# EAGLE design LTF1 (EAGLE 9.6.2)
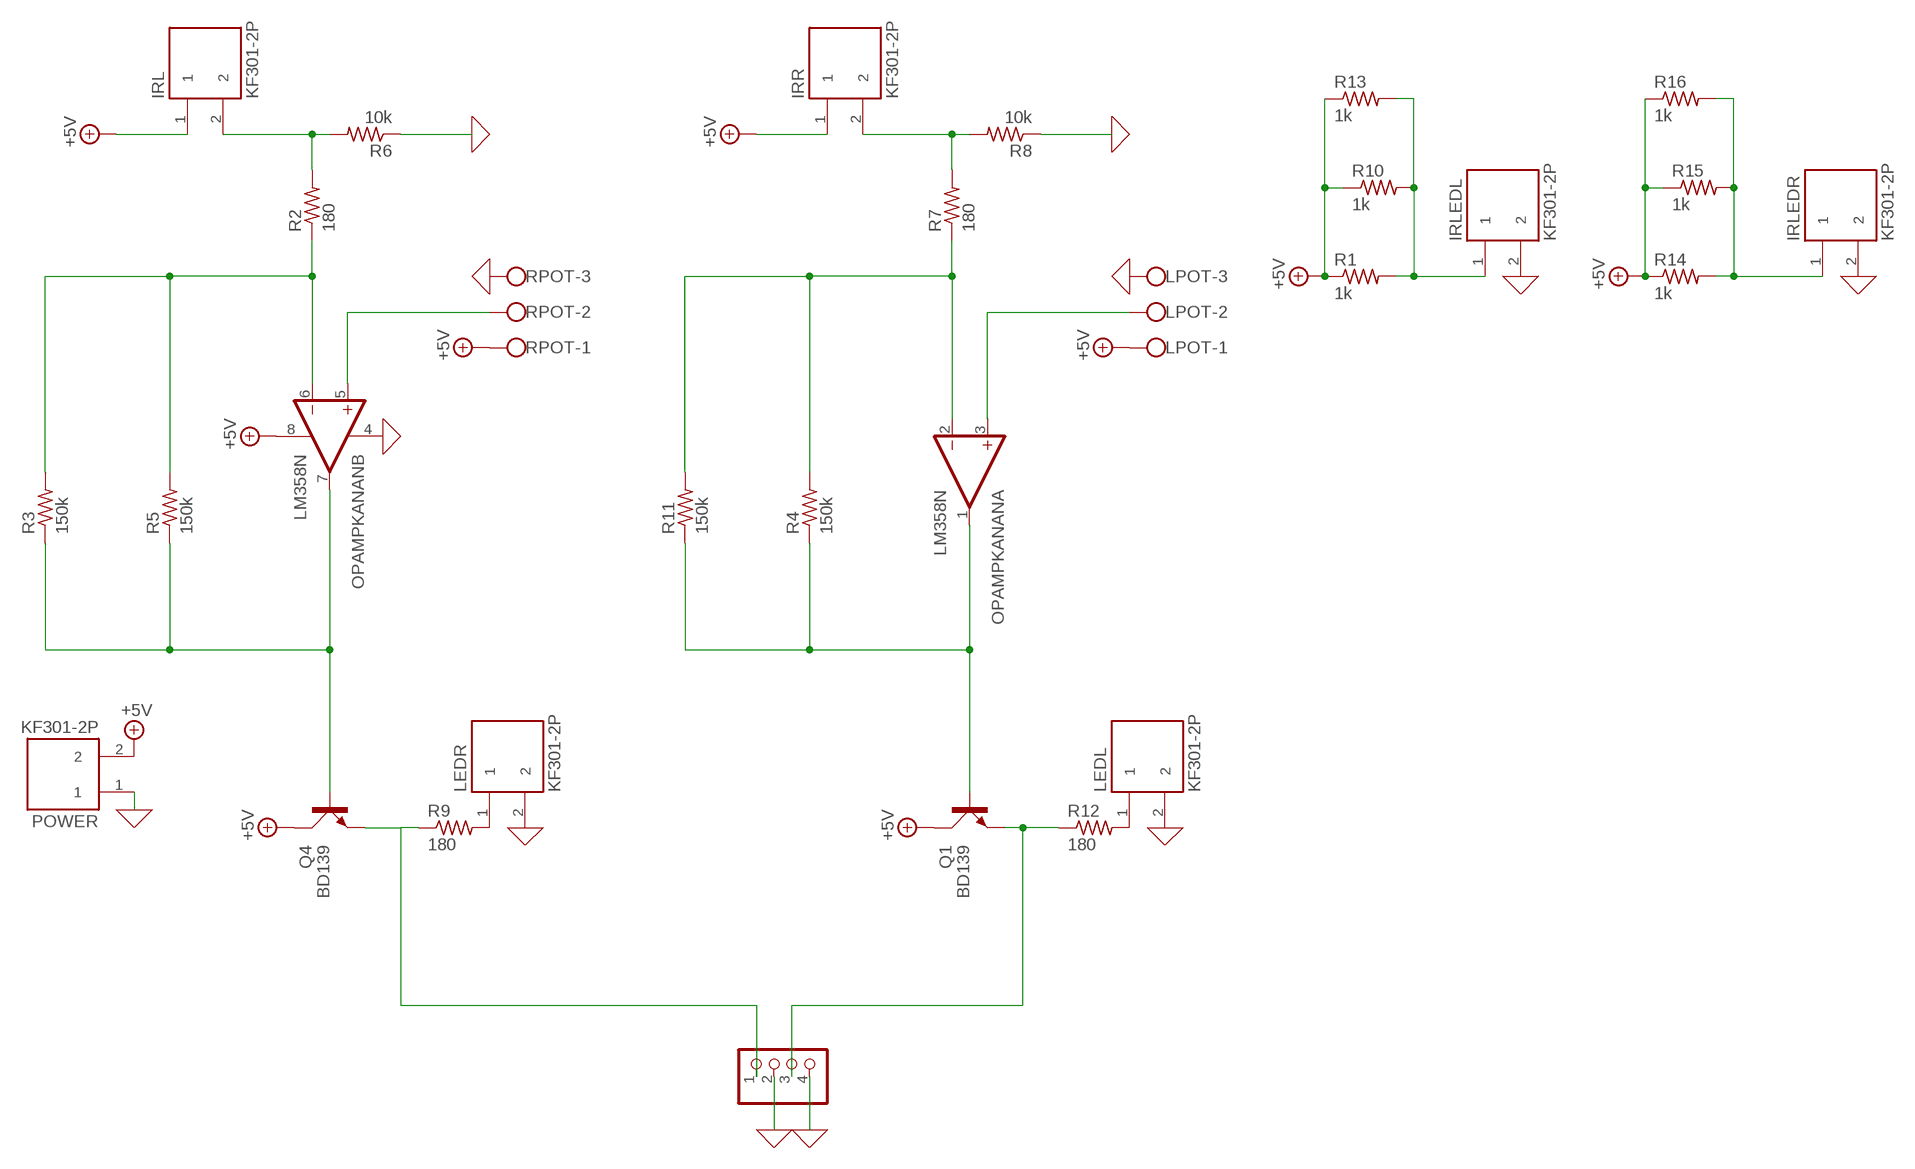
[diagram p0: schematic, sheet 1]

## Parts
IRL  KF301-2P  [HANDSON_KF301-2P]
IRLEDL  KF301-2P  [HANDSON_KF301-2P]
IRLEDR  KF301-2P  [HANDSON_KF301-2P]
IRR  KF301-2P  [HANDSON_KF301-2P]
LEDL  KF301-2P  [HANDSON_KF301-2P]
LEDR  KF301-2P  [HANDSON_KF301-2P]
LPOT  W237-103  [W237-103]
MOTORDRIVER  PINHD-1X4  [1X04]
OPAMPKANAN  LM358N  [DIL08]
POWER  KF301-2P  [HANDSON_KF301-2P]
Q1  BD139  [TO126AV]
Q4  BD139  [TO126AV]
R1  1k  R-US_0204/7  [0204/7]
R2  180  R-US_0204/7  [0204/7]
R3  150k  R-US_0204/7  [0204/7]
R4  150k  R-US_0204/7  [0204/7]
R5  150k  R-US_0204/7  [0204/7]
R6  10k  R-US_0204/7  [0204/7]
R7  180  R-US_0204/7  [0204/7]
R8  10k  R-US_0204/7  [0204/7]
R9  180  R-US_0204/7  [0204/7]
R10  1k  R-US_0204/7  [0204/7]
R11  150k  R-US_0204/7  [0204/7]
R12  180  R-US_0204/7  [0204/7]
R13  1k  R-US_0204/7  [0204/7]
R14  1k  R-US_0204/7  [0204/7]
R15  1k  R-US_0204/7  [0204/7]
R16  1k  R-US_0204/7  [0204/7]
RPOT  W237-103  [W237-103]

## Nets
0: IRLEDL.2 IRLEDR.2 LEDL.2 LEDR.2 LPOT.3 MOTORDRIVER.2 MOTORDRIVER.4 OPAMPKANAN.4(P:V-) POWER.1 R6.1 R8.1 RPOT.3 ; supply symbol labelled GND
+5V: IRL.1 IRR.1 LPOT.1 OPAMPKANAN.8(P:V+) POWER.2 Q1.C Q4.C R1.1 R10.1 R13.1 R14.1 R15.1 R16.1 RPOT.1
IRKIRI: IRL.2 R2.2 R6.2
LEDIRKANAN: IRLEDL.1 R1.2 R10.2 R13.2
LEDIRKANAN1: IRLEDR.1 R14.2 R15.2 R16.2
MOTORKANAN: OPAMPKANAN.7(B:OUT) Q4.B R3.1 R5.1
MOTORKANAN1: OPAMPKANAN.1(A:OUT) Q1.B R4.1 R11.1
N$1: LEDR.1 R9.2
N$2: LEDL.1 R12.2
N$3: OPAMPKANAN.2(A:-IN) R4.2 R7.1 R11.2
N$4: LPOT.2 OPAMPKANAN.3(A:+IN)
N$5: IRR.2 R7.2 R8.2
N$6: MOTORDRIVER.3 Q1.E R12.1
N$7: OPAMPKANAN.6(B:-IN) R2.1 R3.2 R5.2
N$8: MOTORDRIVER.1 Q4.E R9.1
N$10: OPAMPKANAN.5(B:+IN) RPOT.2

## Library data of the parts
IRL IRLEDL IRLEDR IRR LEDL LEDR POWER = KF301-2P:KF301-2P: 2 Pin Terminal Block 5mm Pitch Check availability <https://pricing.snapeda.com/parts/KF301-2P/Handson%20Technology/view-part?ref=eda>; AVAILABILITY: Not in stock; DESCRIPTION: 2 Pin Terminal Block 5mm Pitch; MF: Handson Technology; MP: KF301-2P; PACKAGE: None; PRICE: None
LPOT RPOT = con-wago-500:W237-103: WAGO SCREW CLAMP; MPN: 237-103; OC_FARNELL: unknown; OC_NEWARK: 18M7116
MOTORDRIVER = pinhead:PINHD-1X4: PIN HEADER
OPAMPKANAN = op-amp-long:LM358: OP AMP also LM158; LM258; LM2904 Source: http://cache.national.com/ds/LM/LM158.pdf
Q1 Q4 = transistor-power-small-pad:BD139: NPN TRANSISTOR
R1-R16 = rcl:R-US_: RESISTOR, American symbol; SPICEPREFIX: R

## Board
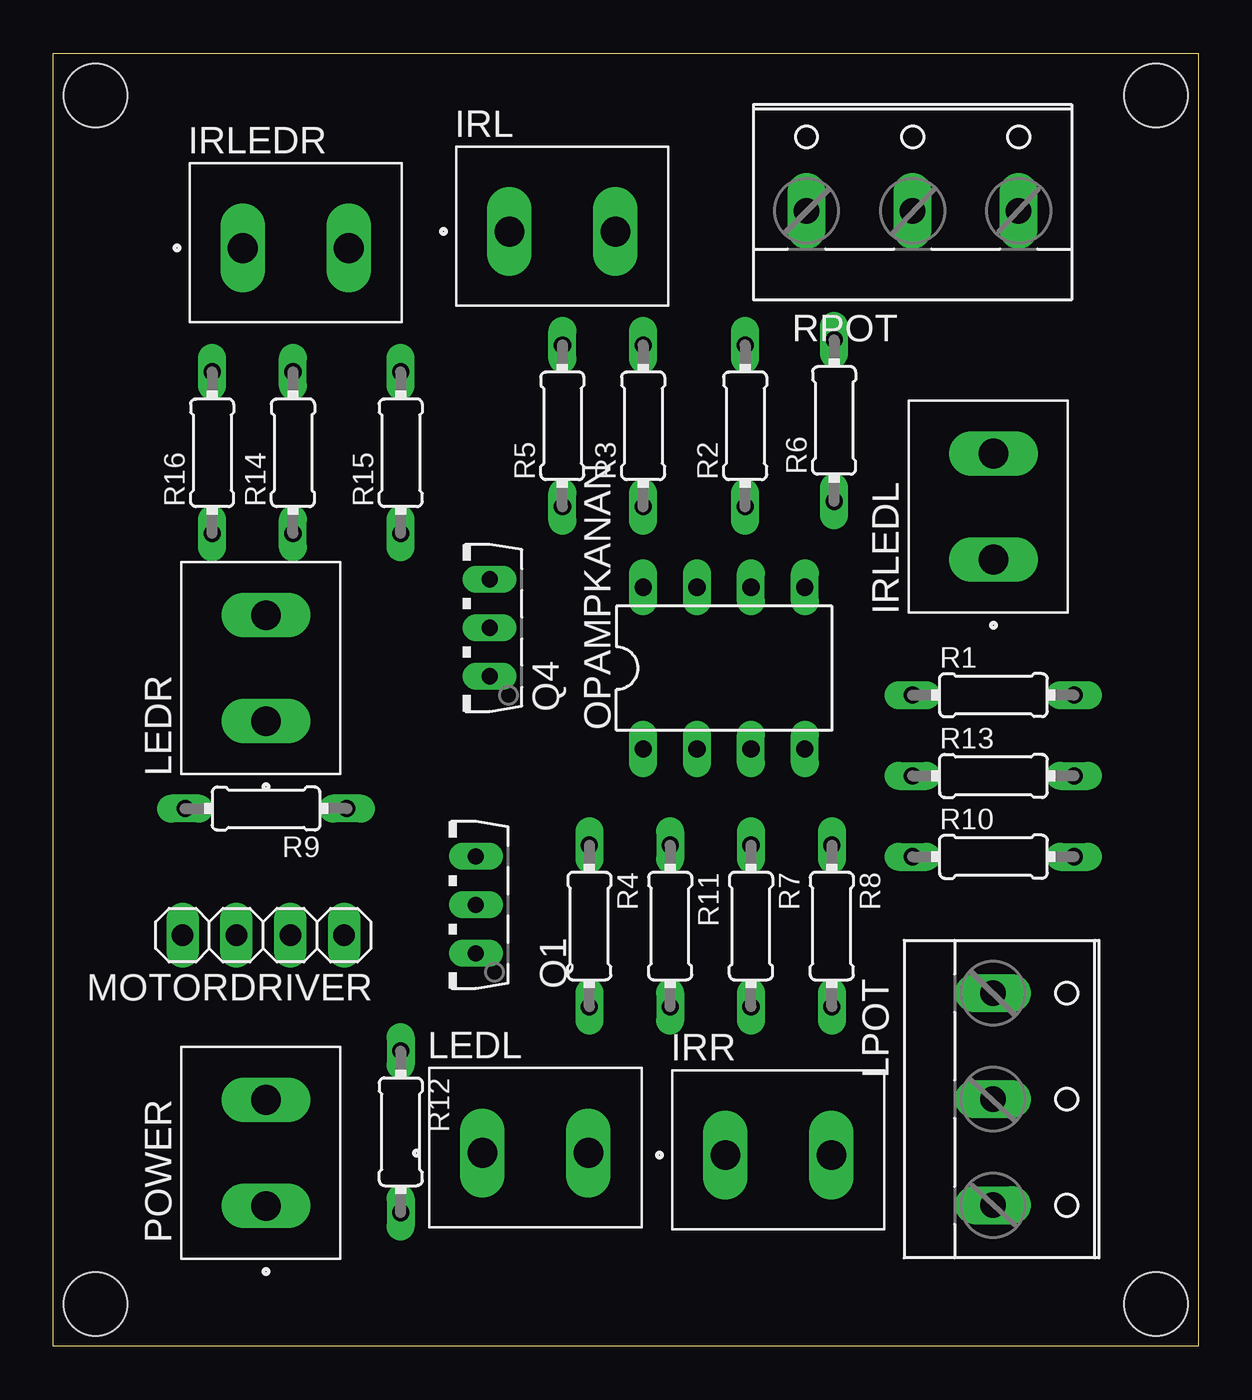
[diagram p1: board, top side]
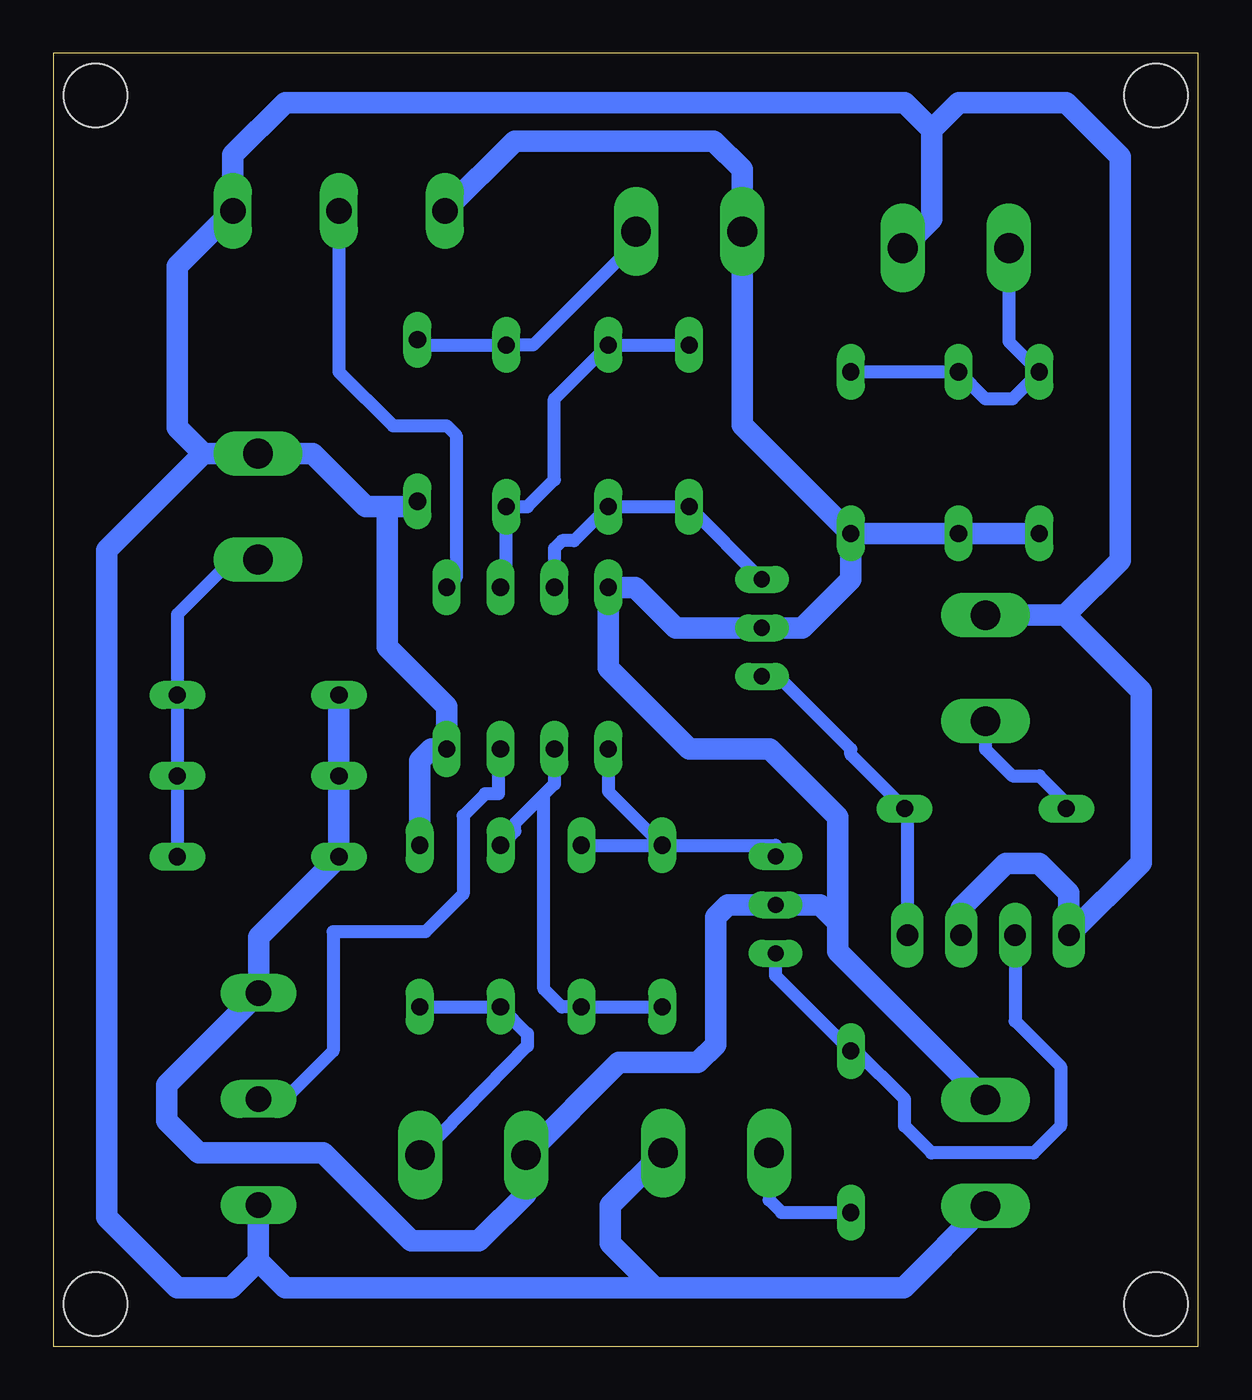
[diagram p2: board, bottom side, seen from below]

Size 54 x 61 mm. Coordinates in mm from the lower left corner, seen from the top.
Outline: 0,0 0,61 54,61 54,0 0,0
Copper layers (1*16): Top 0.035mm / dielectric 1.5mm / Bottom 0.035mm
Design rules "default *": minimum track width 6mil, minimum drill 0.35mm, track to track 0.8mm, track to pad 0.8mm, pad to pad 0.8mm, via to via 0.8mm, smd to smd 0.8mm, copper to edge 40mil, drill to drill 6mil, minimum pad ring 10mil, minimum via ring 8mil, stop-mask expansion 4mil, vias tented up to drill 0mil, thermal gap 10mil
Holes 3 mm at 2,2 52,2 52,59 2,59

### Footprints (pad centres in the part's own frame; a part is rotated, then mirrored left to right if it is on the bottom)
HANDSON_KF301-2P = drill 1.4 long: 1 -2.5,0; 2 2.5,0
W237-103 = drill 1.194 long: 1 -5,-1.29; 2 0,-1.29; 3 5,-1.29
1X04 = drill 1.016 long: 1 -3.81,0; 2 -1.27,0; 3 1.27,0; 4 3.81,0
DIL08 = drill 0.813 pad 1.27 long: 1 -3.81,-3.81; 2 -1.27,-3.81; 3 1.27,-3.81; 4 3.81,-3.81; 5 3.81,3.81; 6 1.27,3.81; 7 -1.27,3.81; 8 -3.81,3.81
TO126AV = drill 0.762 long: B 2.286,-1.27; C 0,-1.27; E -2.286,-1.27
0204/7 = drill 0.813 long: 1 -3.81,0; 2 3.81,0

### Placement (x,y rotation side)
IRL  24.01,52.58 0 top
IRLEDL  44.33,39.61 90 top
IRLEDR  11.44,51.8 0 top
IRR  34.2,9.03 0 top
LEDL  22.74,9.13 0 top
LEDR  10.04,31.99 90 top
LPOT  45.6,11.67 270 top
MOTORDRIVER  9.92,19.4 180 top
OPAMPKANAN  31.63,31.99 0 top
POWER  10.04,9.13 90 top
Q1  18.66,20.83 90 top
Q4  19.31,33.89 90 top
R1  44.33,30.72 0 top
R2  32.63,43.42 90 top
R3  27.82,43.42 90 top
R4  25.28,19.83 270 top
R5  24.01,43.42 90 top
R6  36.82,43.67 90 top
R7  32.9,19.83 270 top
R8  36.71,19.83 270 top
R9  10.04,25.37 180 top
R10  44.33,23.1 0 top
R11  29.09,19.83 270 top
R12  16.39,10.13 270 top
R13  44.33,26.91 0 top
R14  11.31,42.15 90 top
R15  16.39,42.15 90 top
R16  7.5,42.15 90 top
RPOT  40.52,54.85 0 top

### Tracks (layer width: path | path; a pad name or v marks a point on that pad's centre or on a via)
0
  Bottom 1.016: POWER.1 13.89,2.78 25.64,2.78 | 44.33,4.05 43.06,2.78 25.64,2.78 | 44.33,4.05 44.33,6.65 LPOT.3 | 44.33,4.05 45.6,2.78 48.14,2.78 51.46,6.1 51.46,37.56 46.91,42.11 | 46.91,42.11 IRLEDL.2 41.75,42.11 39.25,39.61 38.25,39.61 | 38.25,39.61 37.08,39.61 R6.1 | 38.25,39.61 38.25,32.99 35.44,30.18 OPAMPKANAN.4 36.17,28.18 36.71,27.64 R8.1 | 46.91,42.11 48.14,43.34 48.14,50.94 RPOT.3 45.52,56.2 43.06,58.66 13.85,58.66 12.58,57.39 | 12.58,57.39 12.58,53.16 IRLEDR.2 | 12.58,57.39 11.31,58.66 6.23,58.66 3.69,56.12 3.69,37.07 6.27,34.49 | LEDR.2 6.27,34.49 | 6.27,34.49 2.69,30.91 2.69,22.81 MOTORDRIVER.4 6.11,21.38 7.5,22.78 9.09,22.78 11.19,20.68 MOTORDRIVER.2 | LEDL.2 27.72,6.65 27.72,4.86 25.64,2.78
+5V
  Bottom 1.016: POWER.2 10.04,11.67 17,18.63 17,20 | R15.1 R14.1 R16.1 | R1.1 R13.1 R10.1 44.31,19.31 LPOT.1 48.65,12.33 48.65,10.65 47.13,9.13 41.25,9.13 37.1,4.98 33.93,4.98 31.7,7.21 IRR.1 27.34,13.39 23.61,13.39 22.76,14.24 22.76,20.27 22.2,20.83 Q1.C 17.83,20.83 17,20 | R15.1 21.51,43.46 IRL.1 21.51,55.51 22.84,56.84 32.24,56.84 RPOT.1 | R15.1 16.39,36.18 18.68,33.89 Q4.C 24.65,33.89 26.55,35.8 OPAMPKANAN.8 27.82,31.99 24.01,28.18 20.2,28.18 17,24.98 17,20
IRKIRI
  Bottom 0.61: R6.2 36.57,47.23 R2.2 31.36,47.23 26.55,52.04 26.55,52.54 IRL.2
LEDIRKANAN
  Bottom 0.61: IRLEDL.1 44.37,37.07 45.6,37.07 48.14,34.53 R1.2 R13.2 R10.2
LEDIRKANAN1
  Bottom 0.61: IRLEDR.1 8.94,47.4 R16.2 8.77,44.69 10.04,44.69 R14.2 R15.2
MOTORKANAN
  Bottom 0.61: Q4.B R5.1 R3.1 29.43,38 30,38 30.36,37.64 OPAMPKANAN.7
MOTORKANAN1
  Bottom 0.61: Q1.B 19.93,23.64 R4.1 | OPAMPKANAN.1 27.82,26.18 R4.1 | R11.1 R4.1
N$1
  Bottom 0.61: LEDR.1 10.04,28.18 8.77,26.91 7.5,26.91 6.23,25.64 R9.2
N$2
  Bottom 0.61: LEDL.1 20.24,6.91 19.65,6.32 R12.2
N$3
  Bottom 0.61: R4.2 R11.2 29.98,16.02 30,16 30.86,16.86 30.86,26.03 | OPAMPKANAN.2 30.36,26.52 30.86,26.03 | 30.86,26.03 32.23,24.66 32.23,24.31 R7.1
N$4
  Bottom 0.61: LPOT.2 43.06,11.67 40.79,13.94 40.79,19.56 36.44,19.56 34.67,21.33 34.67,25.03 33.63,26.06 33,26.06 33,28.08 OPAMPKANAN.3
N$5
  Bottom 0.61: R8.2 R7.2 31.63,14.75 31.63,14.17 IRR.2
N$6
  Bottom 0.61: Q1.E 19.93,17.48 R12.1 16.12,13.94 13.85,11.67 13.85,10.4 12.58,9.13 7.77,9.13 6.5,10.4 6.5,13.21 8.64,15.35 MOTORDRIVER.3
N$7
  Bottom 0.61: OPAMPKANAN.6 32.63,36.07 R2.1 31.63,39.61 30.36,40.88 30.36,44.69 R3.2 R5.2
N$8
  Bottom 0.61: MOTORDRIVER.1 13.72,25.24 R9.1 16.39,27.91 16.39,28.18 19.82,31.61 Q4.E
N$10
  Bottom 0.61: RPOT.2 40.52,45.96 37.98,43.42 35.44,43.42 35,42.98 35,36.24 OPAMPKANAN.5